# EAGLE design bday_cake (EAGLE 6.5.0)
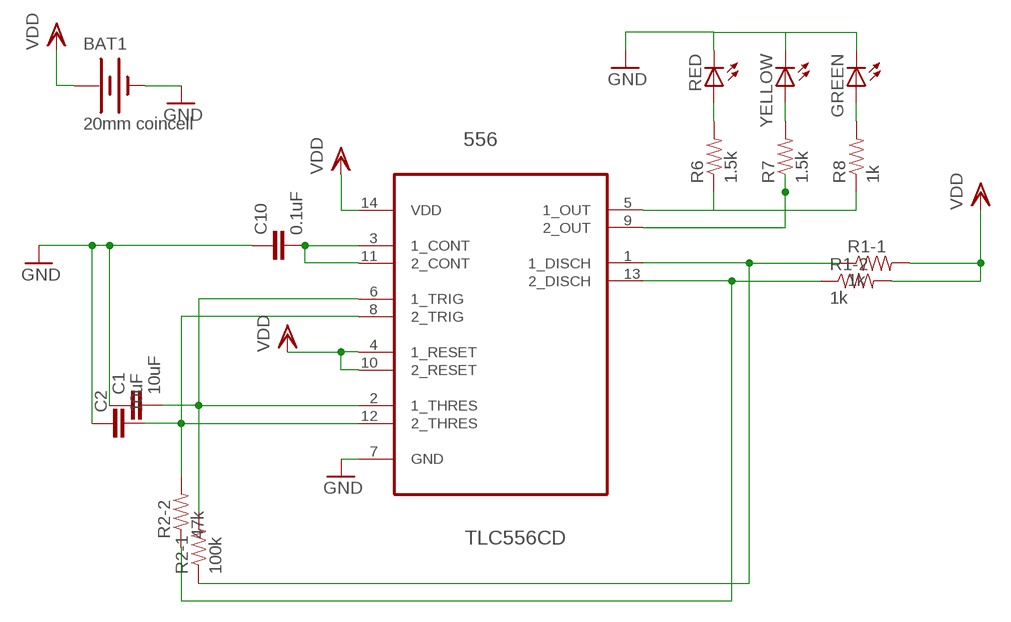
[diagram p0: schematic, sheet 1]

## Parts
556  TLC556CD  [SOIC127P600X175-14N]
BAT1  20mm coincell  CR2032_HOLDER  [CR2032_HOLDER]
C1  10uF  CAP0805  [0805]
C2  10uF  CAP0805  [0805]
C10  0.1uF  CAP0805  [0805]
GREEN  LEDSMT1206  [1206]
R1-1  1k  RESISTOR0805-RES  [0805]
R1-2  1k  RESISTOR0805-RES  [0805]
R2-1  100k  RESISTOR0805-RES  [0805]
R2-2  47k  RESISTOR0805-RES  [0805]
R6  1.5k  RESISTOR0805-RES  [0805]
R7  1.5k  RESISTOR0805-RES  [0805]
R8  1k  RESISTOR0805-RES  [0805]
RED  LEDSMT1206  [1206]
YELLOW  LEDSMT1206  [1206]

## Nets
1DISCH: 556.1(1_DISCH) R1-1.1 R2-1.1
1OUT: 556.5(1_OUT) R6.1 R8.1
1TRIGTHRESH: 556.2(1_THRES) 556.6(1_TRIG) C1.2 R2-1.2
2DISCH: 556.13(2_DISCH) R1-2.1 R2-2.1
2OUT: 556.9(2_OUT) R7.1
2TRIGTHRESH: 556.8(2_TRIG) 556.12(2_THRES) C2.2 R2-2.2
CONT: 556.3(1_CONT) 556.11(2_CONT) C10.2
GND: 556.7(GND) BAT1.CENTER(-) C1.1 C2.1 C10.1 GREEN.C RED.C YELLOW.C
N$9: R6.2 RED.A
N$10: R7.2 YELLOW.A
N$11: GREEN.A R8.2
VDD: 556.4(1_RESET) 556.10(2_RESET) 556.14(VDD) BAT1.VDD1(+) BAT1.VDD2(+) R1-1.2 R1-2.2

## Library data of the parts
556 = Texas Instruments_By_element14_Batch_1:TLC556CD: DUAL LinCMOSE TIMERS; MPN: TLC556CD; OC_FARNELL: 1103187; OC_NEWARK: 08F9146; PACKAGE: SOIC-14; SUPPLIER: Texas Instruments
BAT1 = Nick:CR2032_HOLDER
C1 C2 C10 = SparkFun-Passives:CAP: Capacitor Standard 0603 ceramic capacitor, and 0.1" leaded capacitor.
GREEN RED YELLOW = adafruit:LED: LED OSRAM: - CHIPLED LG R971, LG N971, LY N971, LG Q971, LY Q971, LO R971, LY R971 LH N974, LH R974 LS Q976, LO Q976, LY Q976 LO Q996 - Hyper CHIPLED LW Q18S LB Q993, LB Q99A, LB R99A - SideLED LS A670, LO A670, LY A670, LG A670, LP A670 LB A673, LV A673, LT A673, LW A673 LH A674 LY A675 LS A676, LA A676, LO A676, LY A676, LW A676 LS A679, LY A679, LG A679 - Hyper Micro SIDELED® LS Y876, LA Y876, LO Y876, LY Y876 LT Y87S - SmartLED LW L88C, LW L88S LB L89C, LB L89S, LG L890 LS L89K, LO L89K, LY L89K LS L896, LA L896, LO L896, LY L896 - TOPLED LS T670, LO T670, LY T670, LG T670, LP T670 LSG T670, LSP T670, LSY T670, LOP T670, LYG T670 LG T671, LOG T671, LSG T671 LB T673, LV T673, LT T673, LW T673 LH T674 LS T676, LA T676, LO T676, LY T676, LB T676, LH T676, LSB T676, LW T676 LB T67C, LV T67C, LT T67C, LS T67K, LO T67K, LY T67K, LW E67C LS E67B, LA E67B, LO E67B, LY E67B, LB E67C, LV E67C, LT E67C LW T67C LS T679, LY T679, LG T679 LS T770, LO T770, LY T770, LG T770, LP T770 LB T773, LV T773, LT T773, LW T773 LH T774 LS E675, LA E675, LY E675, LS T675 LS T776, LA T776, LO T776, LY T776, LB T776 LHGB T686 LT T68C, LB T68C - Hyper Mini TOPLED® LB M676 - Mini TOPLED Santana® LG M470 LS M47K, LO M47K, LY M47K Source: http://www.osram.convergy.de/
R1-1 R1-2 R2-1 R2-2 R6-R8 = SparkFun-Passives:RESISTOR: Resistor Basic schematic elements and footprints for 0603, 1206, and PTH resistors.

## Board
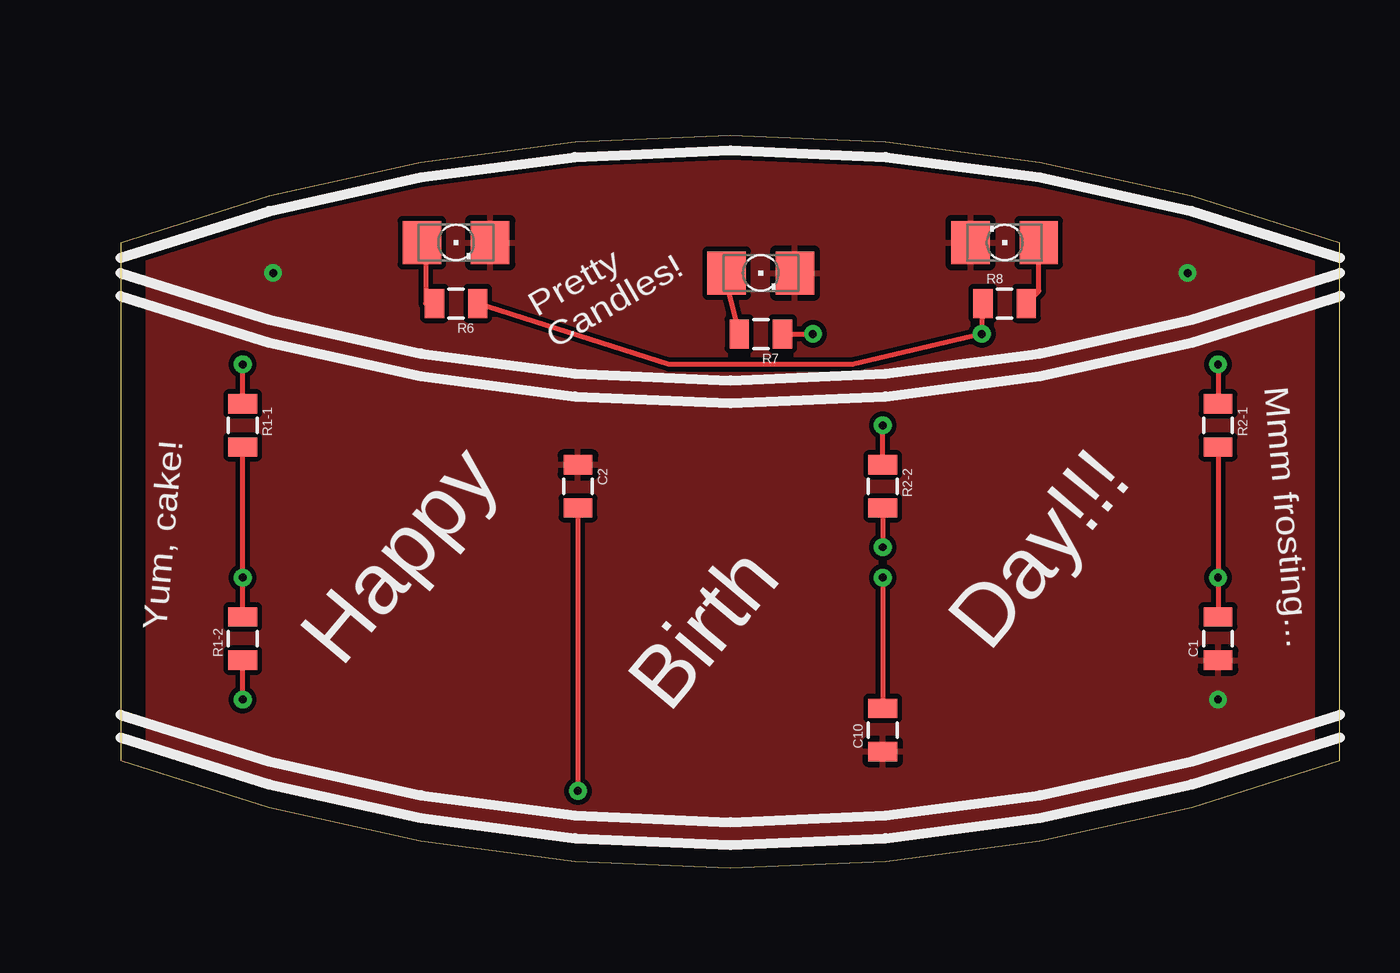
[diagram p1: board, top side]
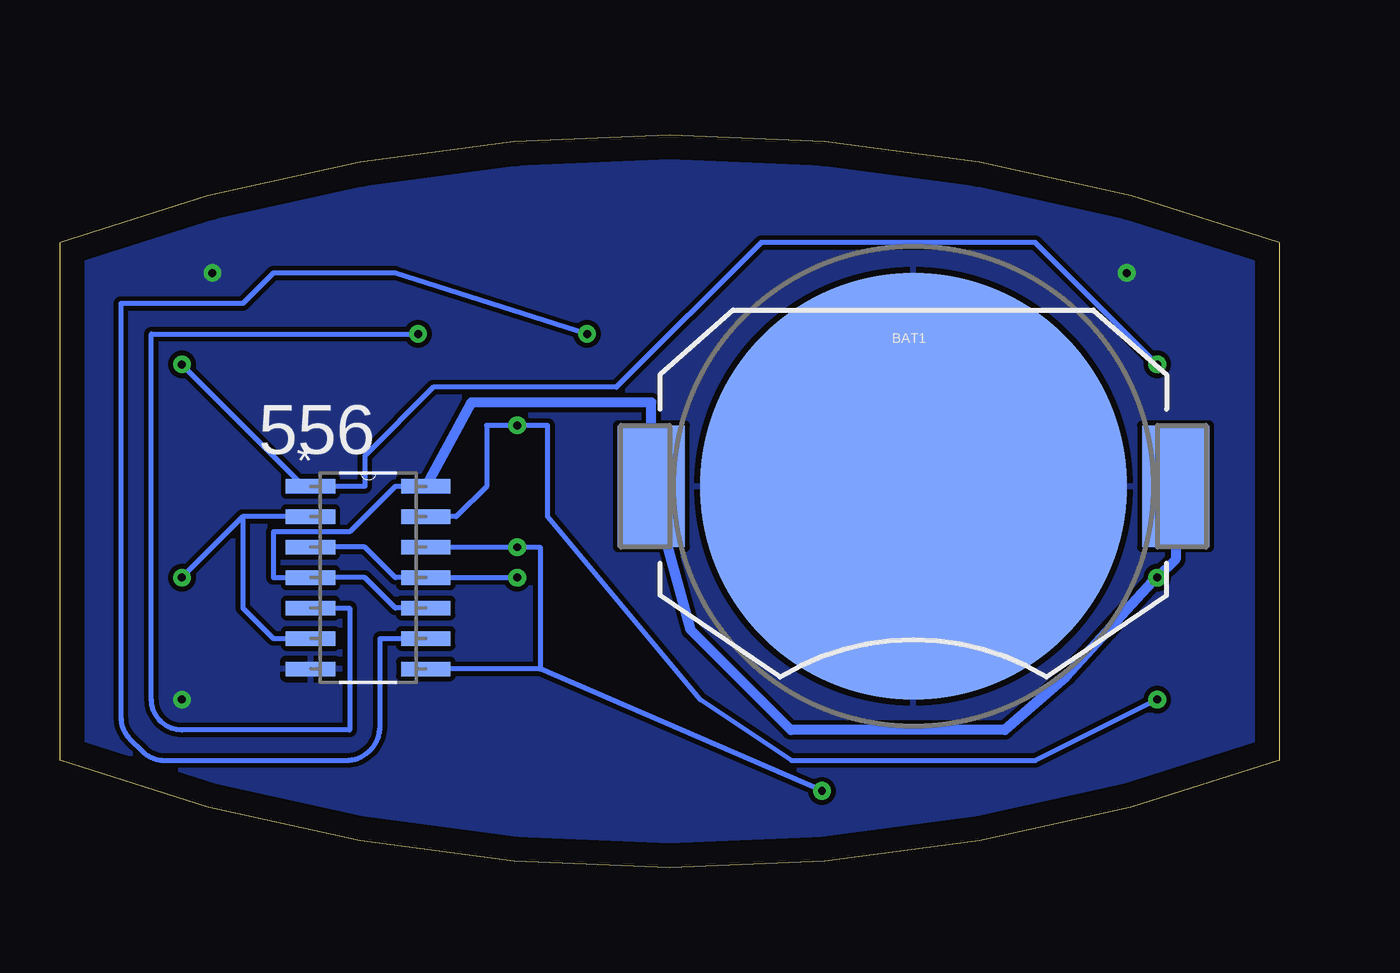
[diagram p2: board, bottom side, seen from below]

Size 50.8 x 30.55 mm. Coordinates in mm from the lower left corner, seen from the top.
Outline: 50.8,4.48 50.8,26.07 arc40 0,26.07 0,4.48 arc40 50.8,4.48
Copper layers (1*16): Top 0.035mm / dielectric 1.5mm / Bottom 0.035mm
Design rules "default *": minimum track width 8mil, minimum drill 13mil, track to track 8mil, track to pad 8mil, pad to pad 8mil, via to via 8mil, smd to smd 8mil, copper to edge 40mil, drill to drill 8mil, minimum pad ring 10mil, minimum via ring 8mil, stop-mask expansion 4mil, vias tented up to drill 0mil, thermal gap 10mil

### Footprints (pad centres in the part's own frame; a part is rotated, then mirrored left to right if it is on the bottom)
SOIC127P600X175-14N = smd 2.057 x 0.61: 1 -4.801,7.62; 2 -4.801,6.35; 3 -4.801,5.08; 4 -4.801,3.81; 5 -4.801,2.54; 6 -4.801,1.27; 7 -4.801,0; 8 0,0; 9 0,1.27; 10 0,2.54; 11 0,3.81; 12 0,5.08; 13 0,6.35; 14 0,7.62
CR2032_HOLDER = smd 17.78 x 17.78: CENTER 0,0 | smd 2.794 x 5.08: VDD1 -10.922,0; VDD2 10.922,0
0805 = smd 0.8 x 1.2: 1 -0.9,0; 2 0.9,0
1206 = smd 1.6 x 1.803: A -1.422,0; C 1.422,0

### Placement (x,y rotation side)
556  35.56,8.29 0 bottom
BAT1  15.24,15.91 0 bottom
C1  45.72,9.56 90 top
C2  19.05,15.91 270 top
C10  31.75,5.75 90 top
GREEN  36.83,26.07 180 top
R1-1  5.08,18.45 270 top
R1-2  5.08,9.56 90 top
R2-1  45.72,18.45 270 top
R2-2  31.75,15.91 270 top
R6  13.97,23.53 180 top
R7  26.67,22.26 180 top
R8  36.83,23.53 0 top
RED  13.97,26.07 0 top
YELLOW  26.67,24.8 0 top

### Tracks (layer width: path | path; a pad name or v marks a point on that pad's centre or on a via)
1DISCH  (via drill 0.33)
  Top 0.203: v45.72,20.99 R2-1.1 | R1-1.1 v5.08,20.99
  Bottom 0.203: v45.72,20.99 40.64,15.91 556.1 38.1,15.91 38.1,17.18 35.24,20.04 27.62,20.04 21.59,26.07 10.16,26.07 v5.08,20.99
1OUT  (via drill 0.33)
  Top 0.203: R8.1 v35.88,22.26 30.48,20.99 22.86,20.99 R6.1
  Bottom 0.203: 556.5 38.73,10.83 38.73,5.75 45.72,5.75 arc90 46.99,7.02 46.99,22.26 v35.88,22.26
1TRIGTHRESH  (via drill 0.33)
  Top 0.203: R2-1.2 v45.72,12.1 C1.2
  Bottom 0.203: 556.6 41.91,9.56 43.18,10.83 43.18,14.64 | 556.2 43.18,14.64 | 43.18,14.64 v45.72,12.1
2DISCH  (via drill 0.33)
  Top 0.203: v5.08,7.02 R1-2.1 | R2-2.1 v31.75,18.45
  Bottom 0.203: v5.08,7.02 10.16,4.48 20.32,4.48 24.13,7.02 30.48,14.64 30.48,18.45 v31.75,18.45 33.02,18.45 33.02,15.91 34.29,14.64 556.13
2OUT  (via drill 0.33)
  Top 0.203: R7.1 v28.84,22.26
  Bottom 0.203: v28.84,22.26 36.83,24.8 41.91,24.8 43.18,23.53 48.26,23.53 48.26,6.27 arc-45 47.89,5.38 47.36,4.85 arc-45 46.46,4.48 38.88,4.48 arc-90 37.47,5.9 37.47,9.56 556.9
2TRIGTHRESH  (via drill 0.33)
  Top 0.203: C2.2 v19.05,3.21 | R2-2.2 v31.75,13.37
  Bottom 0.203: v19.05,3.21 30.8,8.29 | 30.8,8.29 556.8 | 556.12 v31.75,13.37 30.8,13.37 30.8,8.29
CONT  (via drill 0.33)
  Top 0.203: v31.75,12.1 C10.2
  Bottom 0.203: v31.75,12.1 556.11 36.83,12.1 38.1,13.37 556.3
GND  (via drill 0.33)
  Bottom 0.254: BAT1.CENTER 16.51,8.29
  other vias: 6.35,24.8 44.45,24.8 45.72,7.02
  pour Top: 0,31.15 50.8,31.15 50.8,0.67 0,0.67
  pour Bottom: 0,31.15 50.8,31.15 50.8,0.67 0,0.67
N$9
  Top 0.203: R6.2 12.7,23.53 12.7,26.07 RED.A
N$10
  Top 0.203: YELLOW.A 25.25,24.28 R7.2
N$11
  Top 0.203: R8.2 38.25,24.05 GREEN.A
VDD  (via drill 0.33)
  Top 0.203: R1-2.2 v5.08,12.1 R1-1.2
  Bottom 0.203: 556.10 36.83,10.83 38.1,12.1 556.4 41.91,12.1 41.91,14 38.73,14 36.83,15.91 556.14 | 5.08,12.15 v5.08,12.1
  Bottom 0.406: BAT1.VDD2 4.32,12.86 v5.08,12.1 | 556.14 33.66,19.4 26.16,19.4 BAT1.VDD1 24.52,9.93 20.34,5.75 11.43,5.75 8.89,7.97 5.08,12.15

### Text on the board
tPlace: Pretty / Candles! | Mmm frosting... | Yum, cake! | Happy | Day!!! | Birth